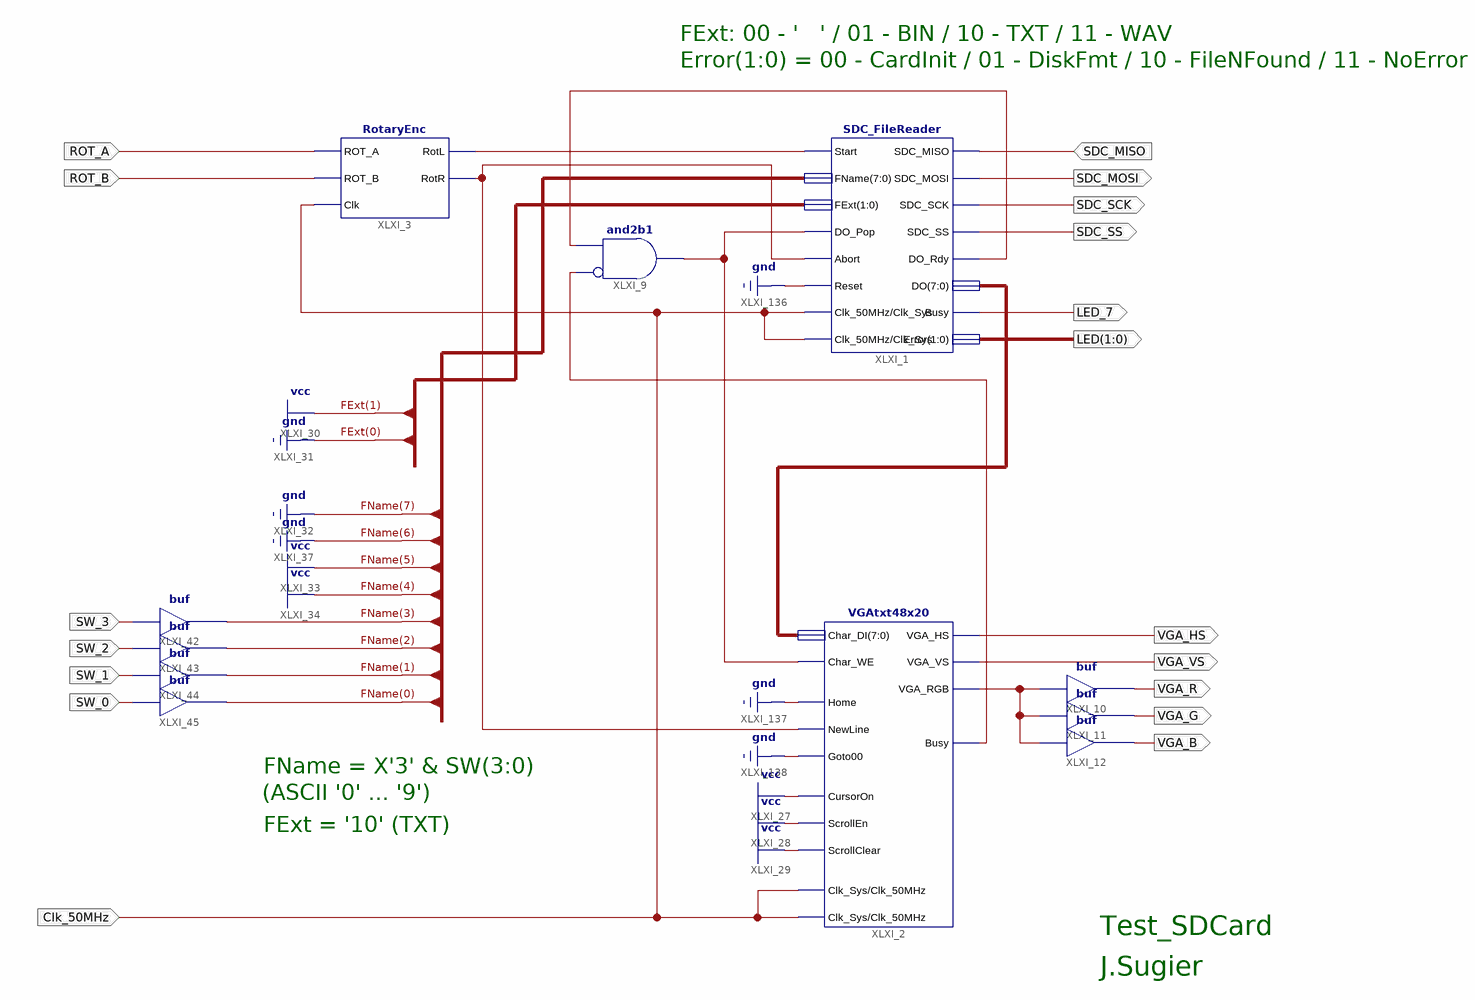
[diagram p0: schematic sheet 1]
// Xilinx ISE schematic Test_SDCard.sch (spartan3e) as structural Verilog: 11 symbols, 18 ports
module Test_SDCard (
  input  SDC_MISO,
  input  ROT_B,
  input  ROT_A,
  input  Clk_50MHz,
  input  SW_3,
  input  SW_2,
  input  SW_1,
  input  SW_0,
  output SDC_SS,
  output SDC_SCK,
  output SDC_MOSI,
  output VGA_G,
  output VGA_B,
  output VGA_R,
  output VGA_VS,
  output VGA_HS,
  output LED_7,
  output [1:0] LED
);

  wire XLXN_7, XLXN_8, XLXN_15, XLXN_17, XLXN_564, XLXN_793;
  wire [3:0] FName;
  wire [7:0] XLXN_5;

  RotaryEnc XLXI_3 (.ROT_A(ROT_A), .ROT_B(ROT_B), .RotL(XLXN_8), .RotR(XLXN_793), .Clk(Clk_50MHz));
  SDC_FileReader XLXI_1 (
    .SDC_MISO(SDC_MISO), .Start(XLXN_8), .FName({4'b0011, FName}), .Reset(1'b0), .Clk_50MHz(Clk_50MHz),
    .DO_Pop(XLXN_7), .Abort(XLXN_793), .SDC_MOSI(SDC_MOSI), .SDC_SCK(SDC_SCK), .SDC_SS(SDC_SS), .Error(LED),
    .DO(XLXN_5), .DO_Rdy(XLXN_15), .Busy(LED_7), .FExt(2'b10), .Clk_Sys(Clk_50MHz));
  buf XLXI_10 (VGA_R, XLXN_564);
  buf XLXI_11 (VGA_G, XLXN_564);
  buf XLXI_12 (VGA_B, XLXN_564);
  and XLXI_9 (XLXN_7, ~XLXN_17, XLXN_15);  // and2b1
  buf XLXI_42 (FName[3], SW_3);
  buf XLXI_43 (FName[2], SW_2);
  buf XLXI_44 (FName[1], SW_1);
  buf XLXI_45 (FName[0], SW_0);
  VGAtxt48x20 XLXI_2 (
    .Char_DI(XLXN_5), .Home(1'b0), .NewLine(XLXN_793), .Goto00(1'b0), .Clk_Sys(Clk_50MHz),
    .Clk_50MHz(Clk_50MHz), .CursorOn(1'b1), .ScrollEn(1'b1), .ScrollClear(1'b1), .Busy(XLXN_17),
    .VGA_HS(VGA_HS), .VGA_VS(VGA_VS), .VGA_RGB(XLXN_564), .Char_WE(XLXN_7));

  // Notes on the sheet:
  //   FExt: 00 - '   ' / 01 - BIN / 10 - TXT / 11 - WAV
  //   Error(1:0) = 00 - CardInit / 01 - DiskFmt / 10 - FileNFound / 11 - NoError
  //   FName = X'3' & SW(3:0)
  //   (ASCII '0' ... '9')
  //   FExt = '10' (TXT)
  //   Test_SDCard
  //   J.Sugier
endmodule
